# EAGLE design ArticulatedPCBLED (EAGLE 9.6.2)
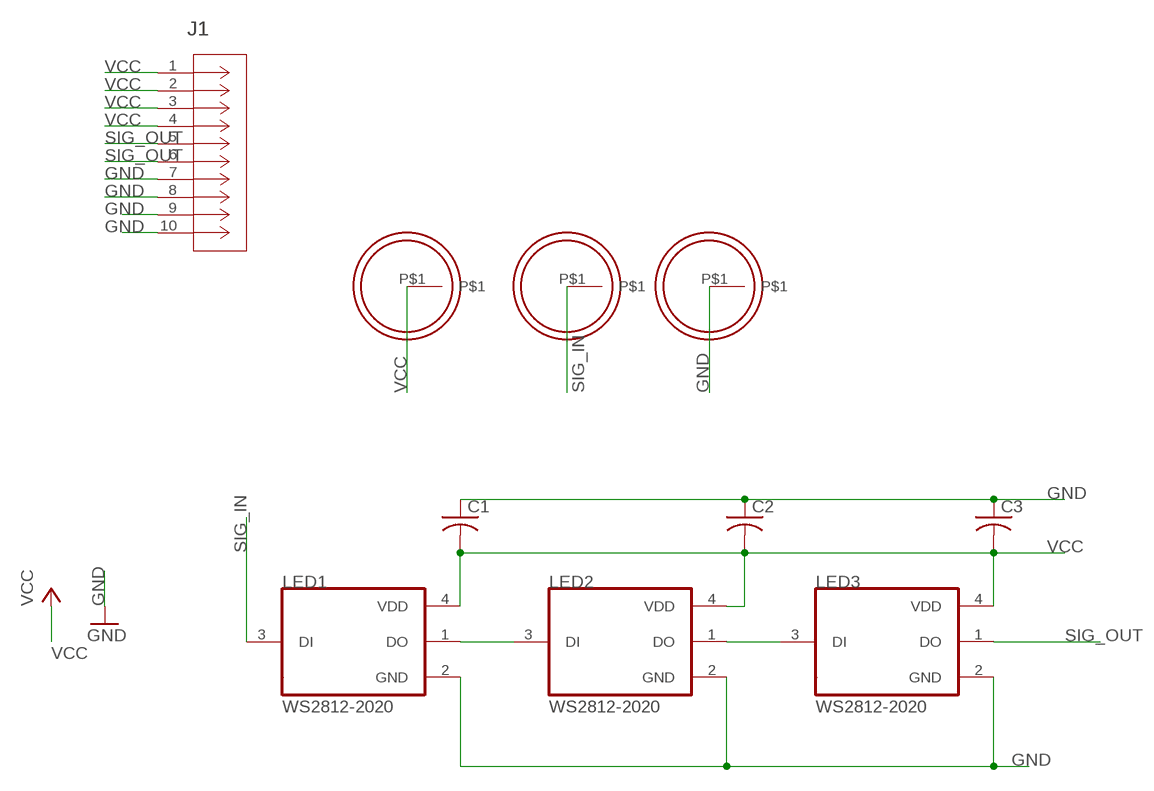
[diagram p0: schematic, sheet 1]

## Parts
C1  C-USC0603  [C0603]
C2  C-USC0603  [C0603]
C3  C-USC0603  [C0603]
J1  DF23C-10DP-0.5V(92)  [CONN_DF23C-10DP-0.5V(92)_HIR]
LED1  WS2812-2020  [LED_WS2812-2020]
LED2  WS2812-2020  [LED_WS2812-2020]
LED3  WS2812-2020  [LED_WS2812-2020]
U$2  CIRCLE_PAD_17_2_OD  [CIRCLE_PAD_17_2_OD]
U$3  CIRCLE_PAD_8_2_OD  [CIRCLE_PAD_8_2_OD]
U$4  CIRCLE_PAD_12_7_OD  [CIRCLE_PAD_12_7_OD]

## Nets
GND: C1.1 C2.1 C3.1 J1.7 J1.8 J1.9 J1.10 LED1.2(GND) LED2.2(GND) LED3.2(GND) U$2.P$1
N$1: LED1.1(DO) LED2.3(DI)
N$4: LED2.1(DO) LED3.3(DI)
SIG_IN: LED1.3(DI) U$4.P$1
SIG_OUT: J1.5 J1.6 LED3.1(DO)
VCC: C1.2 C2.2 C3.2 J1.1 J1.2 J1.3 J1.4 LED1.4(VDD) LED2.4(VDD) LED3.4(VDD) U$3.P$1

## Library data of the parts
C1-C3 = adafruit:C-US: CAPACITOR, American symbol
J1 = debra:DF23C-10DP-0.5V(92); BUILT_BY: EMA_Cory; COPYRIGHT: Copyright (C) 2018 Accelerated Designs. All rights reserved; DATASHEET: https://www.hirose.com/product/download/?distributor=digikey&type=2d&lang=en&num=DF23C-10DP-0.5V(92); MANUFACTURER_PART_NUMBER: DF23C-10DP-0.5V(92); SOURCELIBRARY: Hirose_2020-05-07; VENDOR: Hirose
LED1-LED3 = WS2812-2020:WS2812-2020: Intelligent control LED integrated light source; AVAILABILITY: Unavailable; MF: Worldsemi; MP: WS2812-2020; PACKAGE: Package Analog Devices; PRICE: None
U$2 = debra:CIRCLE_PAD_17_2_OD
U$3 = debra:CIRCLE_PAD_8_2_OD
U$4 = debra:CIRCLE_PAD_12_7_OD

## Board
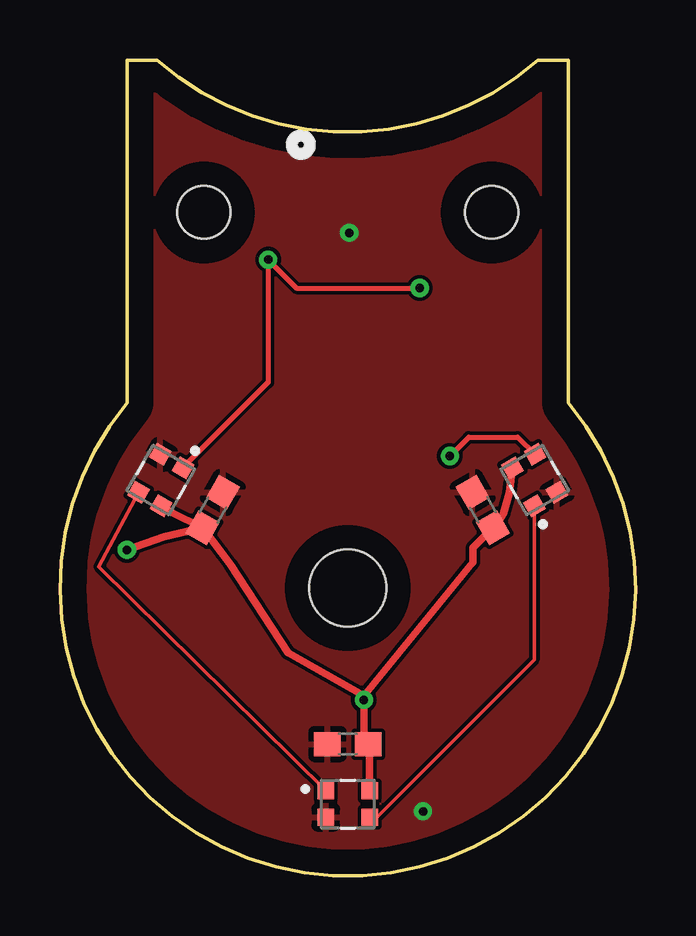
[diagram p1: board, top side]
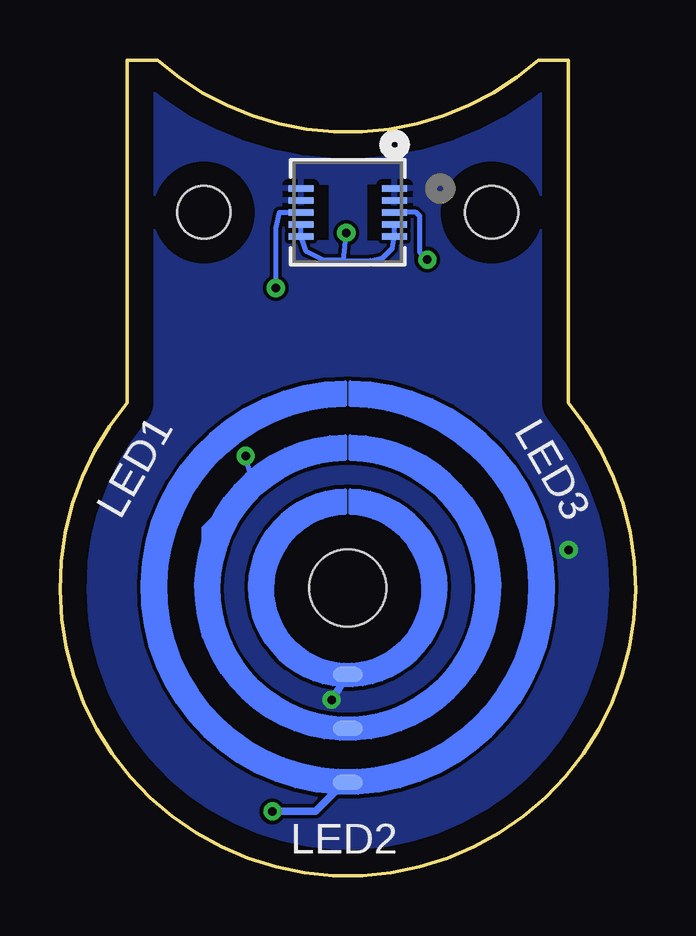
[diagram p2: board, bottom side, seen from below]

Size 24 x 33.99 mm. Coordinates in mm from the lower left corner, seen from the top.
Outline: 19.94,33.99 21.19,33.99 21.19,19.7 arc-260 2.81,19.7 2.81,33.99 4.05,33.99 arc83 19.94,33.99
Copper layers (1*16): Top 0.035mm / dielectric 1.5mm / Bottom 0.035mm
Design rules "default *": minimum track width 6mil, minimum drill 0.35mm, track to track 6mil, track to pad 6mil, pad to pad 6mil, via to via 6mil, smd to smd 6mil, copper to edge 40mil, drill to drill 6mil, minimum pad ring 6mil, minimum via ring 8mil, stop-mask expansion 4mil, vias tented up to drill 16mil, thermal gap 10mil
Holes 3.2 mm at 12,11.99
Holes 2.2 mm at 18,27.64 6,27.64

### Footprints (pad centres in the part's own frame; a part is rotated, then mirrored left to right if it is on the bottom)
C0603 = smd 1.1 x 1: 1 -0.85,0; 2 0.85,0
CONN_DF23C-10DP-0.5V(92)_HIR = smd 0.279 x 1.041: 1 -1,1.95; 2 -1,-1.95; 3 -0.5,1.95; 4 -0.5,-1.95; 5 0,1.95; 6 0,-1.95; 7 0.5,1.95; 8 0.5,-1.95; 9 1,1.95; 10 1,-1.95
LED_WS2812-2020 = smd 0.7 x 0.7: 1 -0.915,0.55; 2 -0.915,-0.55; 3 0.915,-0.55; 4 0.915,0.55
CIRCLE_PAD_17_2_OD = smd 1.27 x 0.635: P$1 0,-8.1
CIRCLE_PAD_8_2_OD = smd 1.27 x 0.635: P$1 0,-3.6
CIRCLE_PAD_12_7_OD = smd 1.27 x 0.635: P$1 0,-5.85

### Placement (x,y rotation side)
C1  17.63,15.24 300 top
C2  12,5.49 0 top
C3  6.37,15.24 240 top
J1  12,27.64 270 bottom
LED1  19.79,16.49 120 top
LED2  12,2.99 0 top
LED3  4.21,16.49 240 top
U$2  12,11.99 0 bottom
U$3  12,11.99 0 bottom
U$4  12,11.99 0 bottom

### Tracks (layer width: path | path; a pad name or v marks a point on that pad's centre or on a via)
GND  (via drill 0.35)
  Bottom 0.152: U$2.P$1 12.13,3.89
  Bottom 0.2: J1.10 J1.8
  Bottom 0.203: v12.07,26.78 12.19,25.64 | J1.7 J1.9 10.14,26.14 10.52,25.76 11.06,25.63 12.19,25.64 | J1.10 13.73,26.01 12.98,25.64 12.19,25.64
  Bottom 0.305: v15.14,2.68 13.34,2.68 12.13,3.89
  pour Top: -0.51,-0.29 -0.51,39.03 27.18,38.57 27.18,-0.75
N$1
  Top 0.152: LED2.3 13.21,2.44 19.78,9 LED1.1
N$4
  Top 0.152: LED3.3 1.62,12.87 LED2.1
SIG_IN  (via drill 0.35)
  Top 0.203: v16.25,17.49 17.04,18.27 19.09,18.27 LED1.3
  Bottom 0.203: U$4.P$1 12.35,6.49 14.5,6.49 17,8.99 17,9.49 17.5,9.49 18,9.99 18,14.49 16,16.49 v16.25,17.49
SIG_OUT  (via drill 0.35)
  Top 0.152: 5.18,17.06 LED3.1
  Top 0.203: 5.18,17.06 8.68,20.55 v8.68,25.67 9.86,24.49 v15,24.49
  Bottom 0.203: J1.5 9.15,27.64 9,27.49 9,25.99 v8.68,25.67 | v15,24.49 15,26.99 14.85,27.64 J1.6
VCC  (via drill 0.35)
  Top 0.152: C1.2 18.14,14.46
  Top 0.305: 18.14,14.46 18.49,15.07 18.73,15.95 LED1.4 | 12.68,7.5 v12.68,7.33 12.68,5.99 C2.2 12.92,5.42 LED2.4 | 12.68,7.5 9.52,9.28 7.11,12.96 6.73,13.46 C3.2 | C1.2 17.22,13.67 17.22,13.07 12.68,7.5 | C3.2 4.64,15.14 LED3.4 | v2.79,13.58 4.35,14.12 C3.2
  Bottom 0.305: v12.68,7.33 12.42,7.71 U$3.P$1
  pour Bottom: -0.38,-0.28 -0.38,39.16 27.18,38.86 27.18,-0.59